# Altium schematic sheet frontSide.SchDoc
size A4
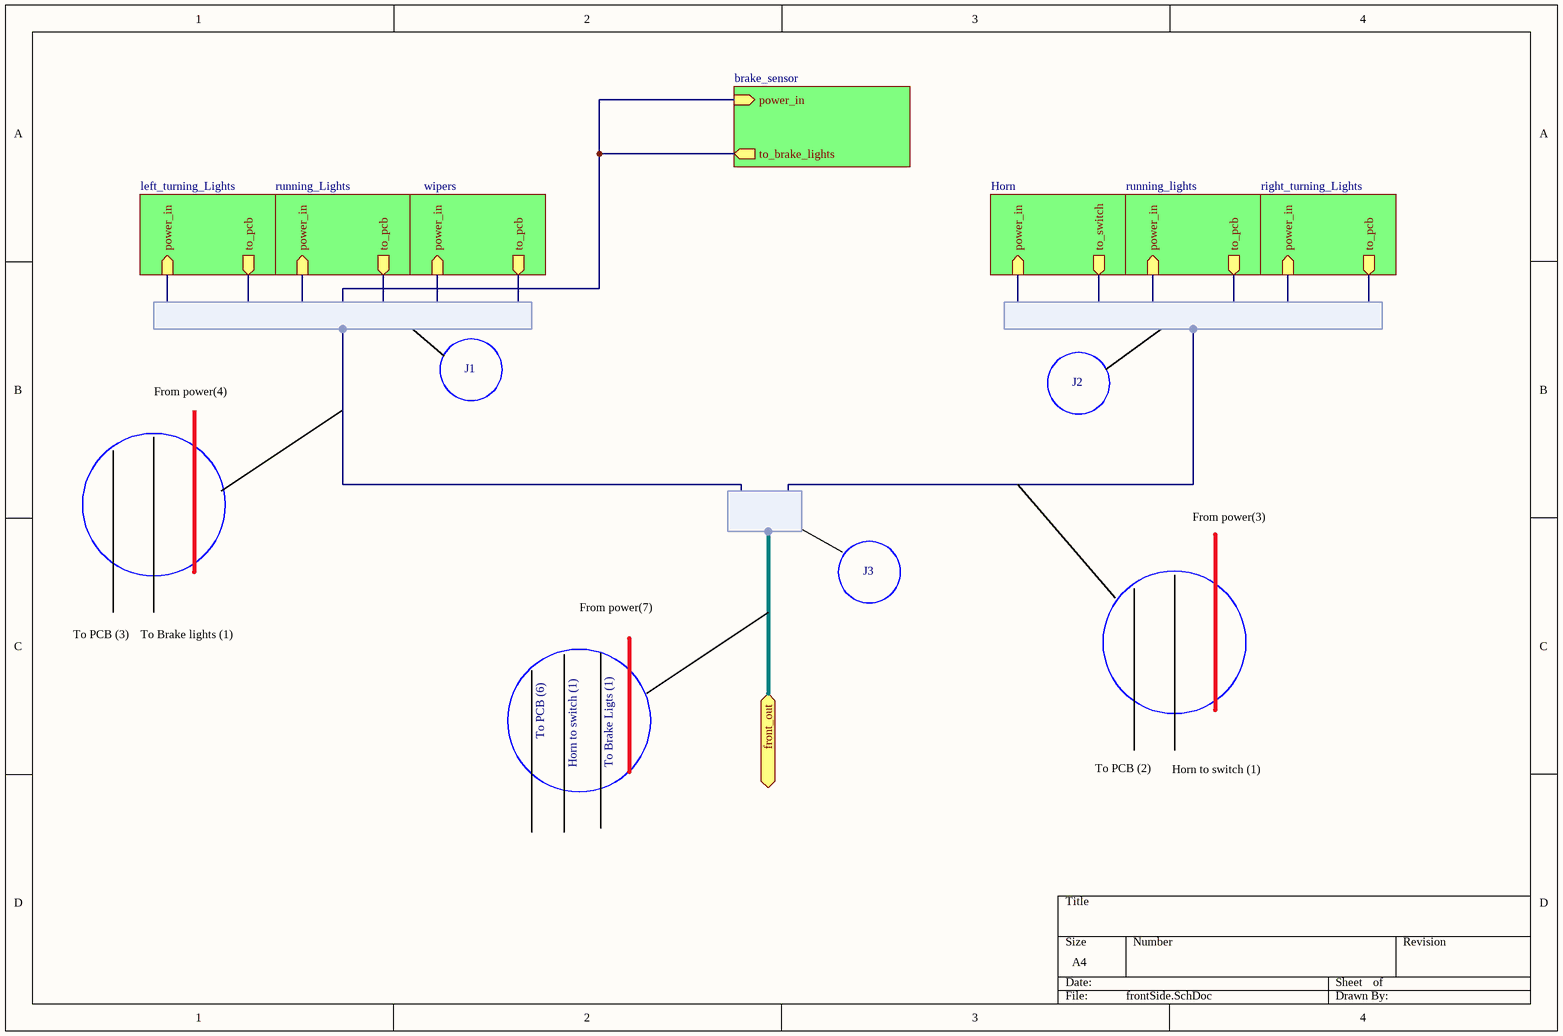
[diagram p0: frontSide.SchDoc]

## Sub-sheets
Designator = running_Lights: power_in (in), to_pcb (out)
Designator = wipers: power_in (in), to_pcb (out)
Designator = Horn: power_in (in), to_switch (out)
Designator = running_lights: power_in (in), to_pcb (out)
Designator = left_turning_Lights: power_in (in), to_pcb (out)
Designator = right_turning_Lights: power_in (in), to_pcb (out)
Designator = brake_sensor: power_in (in), to_brake_lights (out)

## Ports
front_out (bidir)

## Harnesses
Harness: 

## Nets
(unnamed): sheet Designator/power_in, sheet Designator/to_brake_lights

## Notes on the sheet
- J1
- J2
- From power(4)
- J3
- From power(3)
- To PCB (3)
- To Brake lights (1)
- From power(7)
- To PCB (6)
- Horn to switch (1)
- To Brake Ligts (1)
- To PCB (2)